# EAGLE design deskav2 (EAGLE 6.5.0)
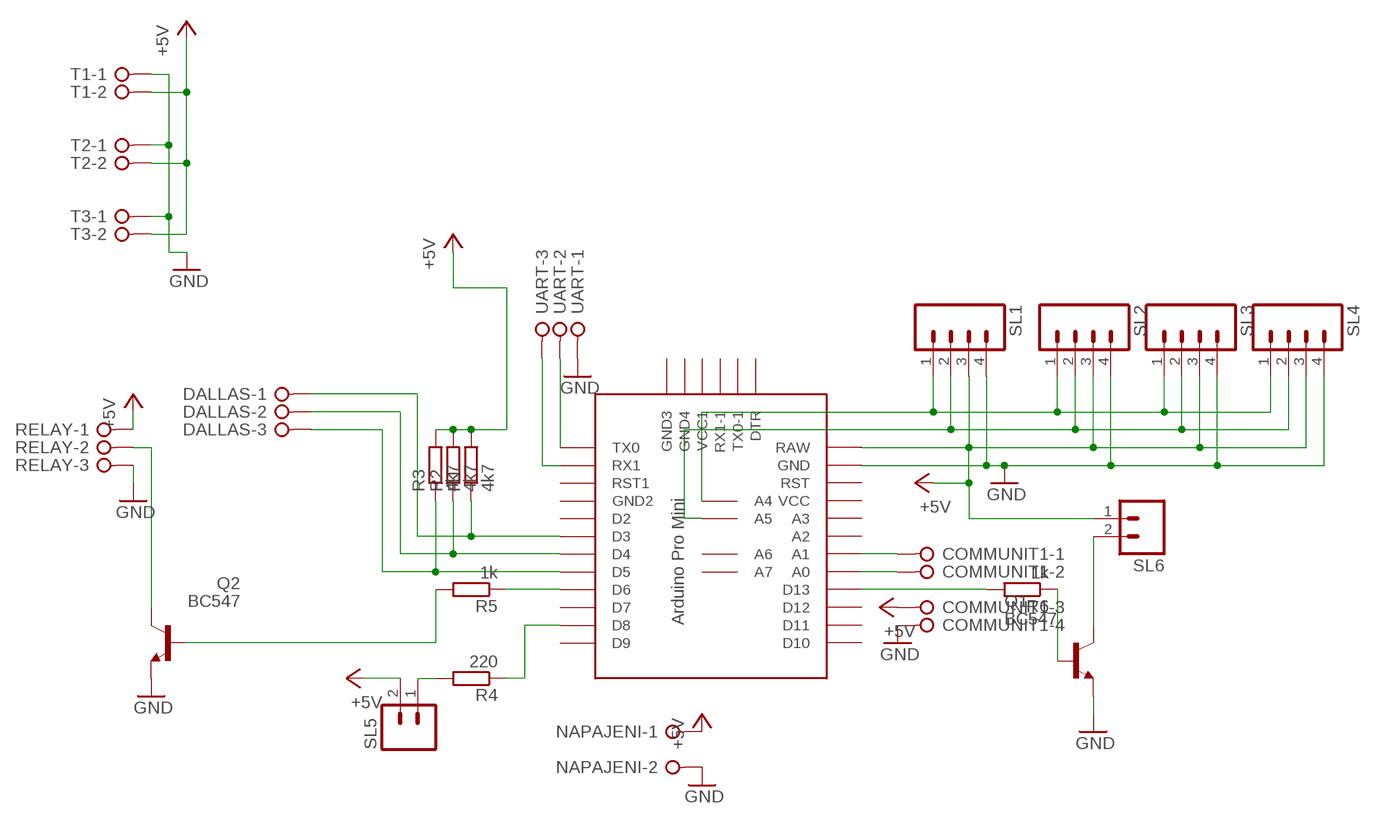
[diagram p0: schematic, sheet 1]

## Parts
COMMUNIT1  W237-04P  [W237-4P]
DALLAS  W237-3E  [W237-3E]
NAPAJENI  W237-02P  [W237-132]
Q1  BC547  [TO92]
Q2  BC547  [TO92]
R1  4k7  R-EU_0207/7  [0207/7]
R2  4k7  R-EU_0207/7  [0207/7]
R3  4k7  R-EU_0207/7  [0207/7]
R4  220  R-EU_0207/7  [0207/7]
R5  1k  R-EU_0207/7  [0207/7]
R6  1k  R-EU_0207/7  [0207/7]
RELAY  W237-3E  [W237-3E]
SL1  M04  [04P]
SL2  M04  [04P]
SL3  M04  [04P]
SL4  M04  [04P]
SL5  M02  [02P]
SL6  M02  [02P]
T1  W237-02P  [W237-132]
T2  W237-02P  [W237-132]
T3  W237-02P  [W237-132]
U$1  PRO-MINI-2  [PRO-MINI-2]
UART  W237-3E  [W237-3E]

## Nets
+5V: COMMUNIT1.3 NAPAJENI.1 R1.2 R2.2 R3.2 RELAY.1 SL1.3 SL2.3 SL3.3 SL4.3 SL5.2 SL6.1 T1.2 T2.2 T3.2 U$1.RAW
GND: COMMUNIT1.4 NAPAJENI.2 Q1.1(E) Q2.1(E) RELAY.3 SL1.4 SL2.4 SL3.4 SL4.4 T1.1 T2.1 T3.1 U$1.GND UART.1
N$2: DALLAS.2 R2.1 U$1.D4
N$3: DALLAS.3 R3.1 U$1.D5
N$4: R5.1 U$1.D6
N$5: R4.1 U$1.D8
N$6: R4.2 SL5.1
N$7: Q1.2(B) R6.1
N$8: COMMUNIT1.1 U$1.A1
N$9: U$1.TX0 UART.2
N$10: U$1.RX1 UART.3
N$11: SL1.1 SL2.1 SL3.1 SL4.1 U$1.A4
N$12: SL1.2 SL2.2 SL3.2 SL4.2 U$1.A5
N$13: Q2.2(B) R5.2
N$14: Q2.3(C) RELAY.2
N$15: Q1.3(C) SL6.2
N$16: R6.2 U$1.D13
N$17: COMMUNIT1.2 U$1.A0
N$18: DALLAS.1 R1.1 U$1.D3
Unconnected: U$1.A2 U$1.A3 U$1.A6 U$1.A7 U$1.D2 U$1.D7 U$1.D9 U$1.D10 U$1.D11 U$1.D12 U$1.DTR U$1.GND1(GND2) U$1.GND2(GND3) U$1.GND3(GND4) U$1.RST U$1.RST1 U$1.RX1-1 U$1.TX0-1 U$1.VCC U$1.VCC1

## Library data of the parts
COMMUNIT1 = con-wago-508:W237-04P: WAGO SREW CLAMP; OC_FARNELL: unknown; OC_NEWARK: unknown
DALLAS RELAY UART = con-wago-508:W237-3E: WAGO SREW CLAMP; OC_FARNELL: unknown; OC_NEWARK: unknown
NAPAJENI T1-T3 = con-wago-508:W237-02P: WAGO SREW CLAMP; OC_FARNELL: unknown; OC_NEWARK: unknown
Q1 Q2 = transistor-npn:BC547*: NPN Transistor
R1-R6 = rcl:R-EU_: RESISTOR, European symbol
SL1-SL4 = con-amp-quick:M04: AMP QUICK CONNECTOR; OC_FARNELL: unknown; OC_NEWARK: unknown
SL5 SL6 = con-amp-quick:M02: AMP QUICK CONNECTOR; OC_FARNELL: unknown; OC_NEWARK: unknown
U$1 = Arduino-clone:PRO-MINI-2: Arduino Pro Mini Layout 2 Sparkfun.com

## Board
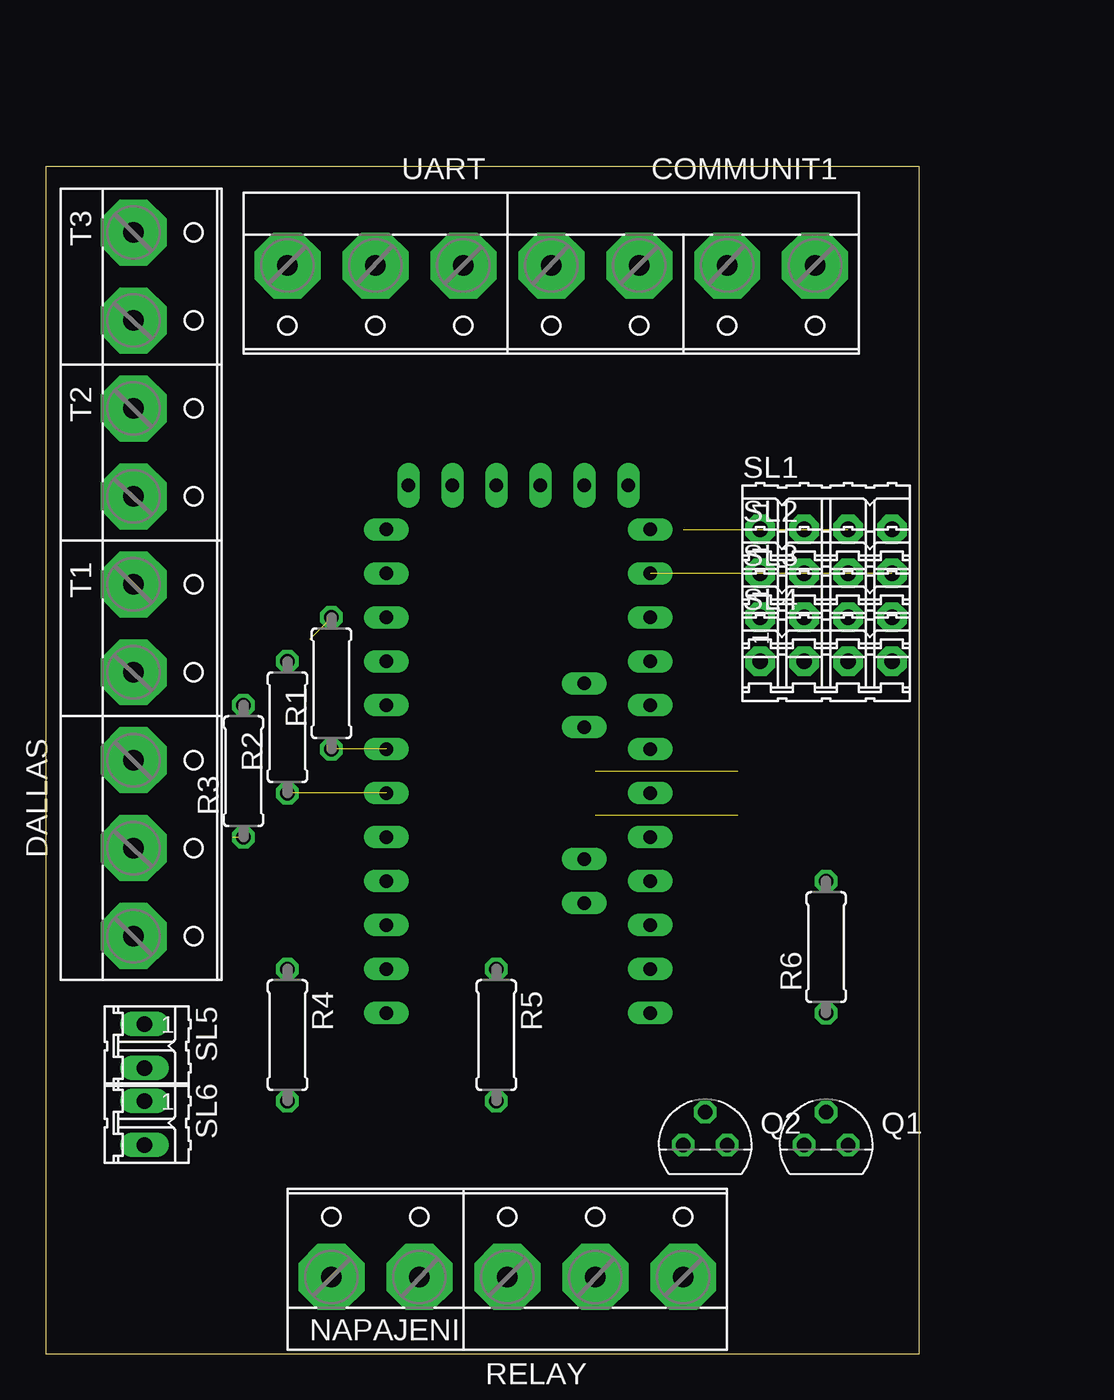
[diagram p1: board, top side]
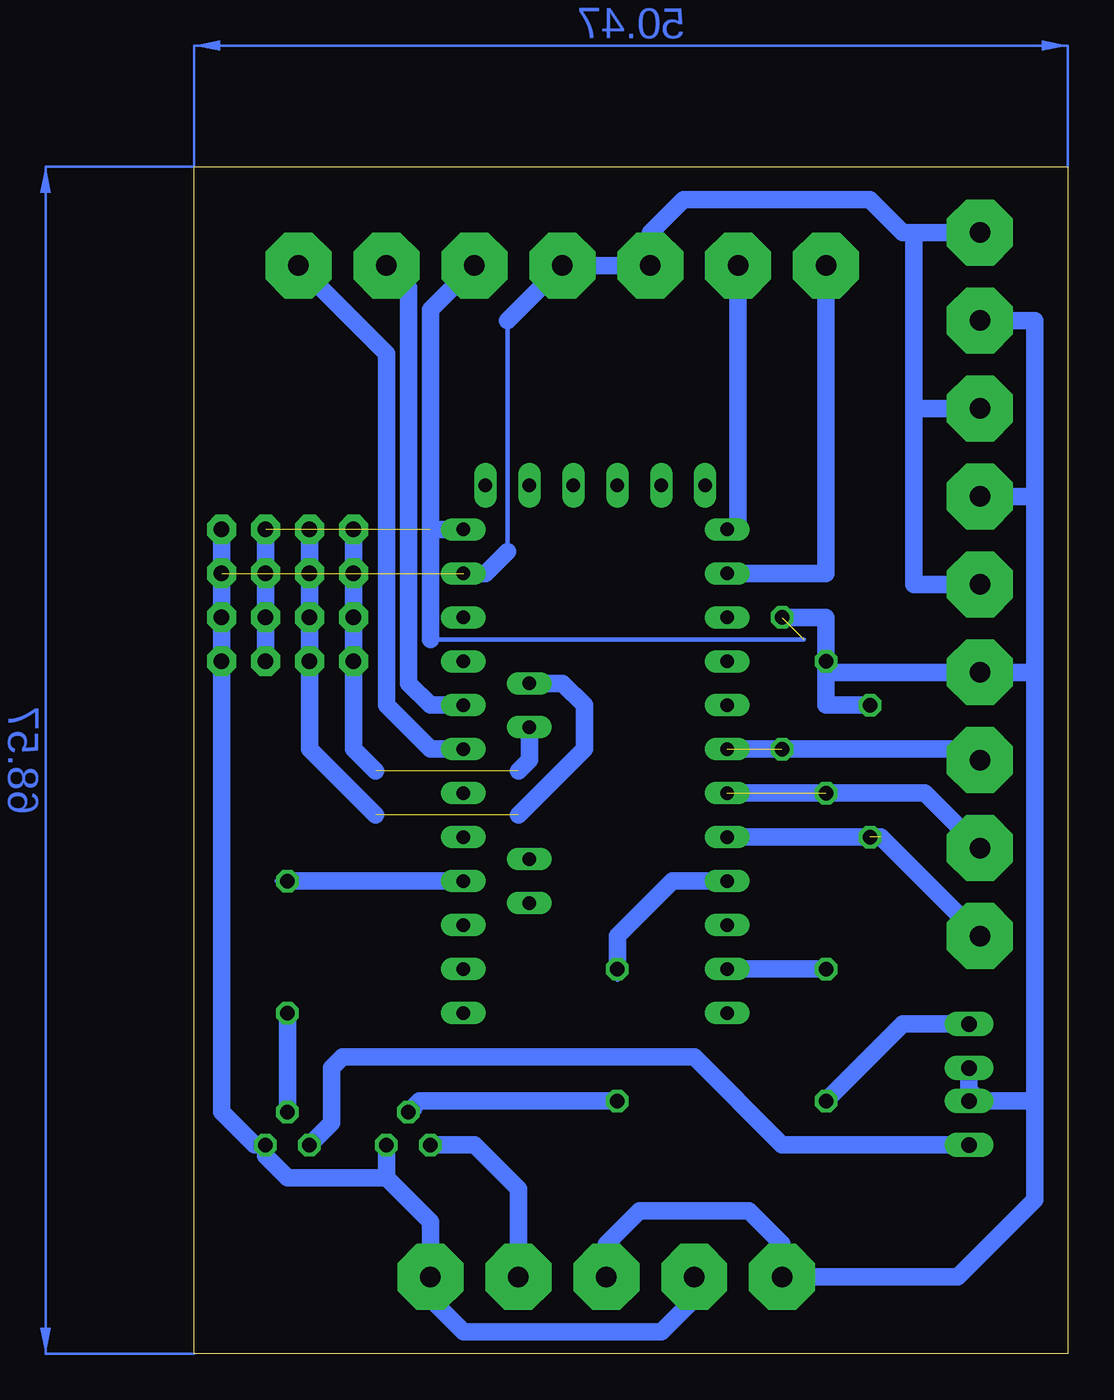
[diagram p2: board, bottom side, seen from below]

Size 50.47 x 68.57 mm. Coordinates in mm from the lower left corner, seen from the top.
Outline: 0,0 50.47,0 50.47,68.57 0,68.57 0,0
Copper layers (1*16): Top 0.035mm / dielectric 1.5mm / Bottom 0.035mm
Design rules "default": minimum track width 10mil, minimum drill 24mil, track to track 8mil, track to pad 8mil, pad to pad 8mil, via to via 8mil, smd to smd 8mil, copper to edge 40mil, drill to drill 8mil, minimum pad ring 10mil, minimum via ring 8mil, stop-mask expansion 4mil, vias tented up to drill 0mil, thermal gap 10mil

### Footprints (pad centres in the part's own frame; a part is rotated, then mirrored left to right if it is on the bottom)
W237-4P = drill 1.194 pad 3.81 octagon: 1 -7.62,-0.635; 2 -2.54,-0.635; 3 2.54,-0.635; 4 7.62,-0.635
W237-3E = drill 1.194 pad 3.81 octagon: 1 -5.08,-0.635; 2 0,-0.635; 3 5.08,-0.635
W237-132 = drill 1.194 pad 3.81 octagon: 1 -2.54,-0.635; 2 2.54,-0.635
TO92 = drill 0.813 octagon: 1 1.27,0; 2 0,1.905; 3 -1.27,0
0207/7 = drill 0.813 octagon: 1 -3.81,0; 2 3.81,0
04P = drill 0.914 pad 1.676 octagon: 1 -3.81,0; 2 -1.27,0; 3 1.27,0; 4 3.81,0
02P = drill 0.914 long: 1 -1.27,0; 2 1.27,0
PRO-MINI-2 = drill 0.8 long: A0 6.35,2.54; A1 6.35,0; A2 6.35,-2.54; A3 6.35,-5.08; A4 2.54,1.27; A5 2.54,3.81; A6 2.54,-8.89; A7 2.54,-6.35; D2 -8.89,2.54; D3 -8.89,0; D4 -8.89,-2.54; D5 -8.89,-5.08; D6 -8.89,-7.62; D7 -8.89,-10.16; D8 -8.89,-12.7; D9 -8.89,-15.24; D10 6.35,-15.24; D11 6.35,-12.7; D12 6.35,-10.16; D13 6.35,-7.62; DTR 5.08,15.24; GND 6.35,10.16; GND1 -8.89,5.08; GND2 -7.62,15.24; GND3 -5.08,15.24; RAW 6.35,12.7; RST 6.35,7.62; RST1 -8.89,7.62; RX1 -8.89,10.16; RX1-1 0,15.24; TX0 -8.89,12.7; TX0-1 2.54,15.24; VCC 6.35,5.08; VCC1 -2.54,15.24

### Placement (x,y rotation side)
COMMUNIT1  36.83,62.23 180 top
DALLAS  5.71,29.21 270 top
NAPAJENI  19.05,5.08 0 top
Q1  45.09,12.06 0 top
Q2  38.1,12.06 0 top
R1  16.51,38.73 90 top
R2  13.97,36.2 90 top
R3  11.43,33.66 90 top
R4  13.97,18.41 270 top
R5  26.04,18.41 270 top
R6  45.09,23.5 90 top
RELAY  31.75,5.08 0 top
SL1  45.09,47.62 0 top
SL2  45.09,45.09 0 top
SL3  45.09,42.55 0 top
SL4  45.09,40.01 0 top
SL5  5.71,17.78 270 top
SL6  5.71,13.34 270 top
T1  5.71,41.91 270 top
T2  5.71,52.07 270 top
T3  5.71,62.23 270 top
U$1  28.57,34.92 0 top
UART  19.05,62.23 180 top

### Tracks (layer width: path | path; a pad name or v marks a point on that pad's centre or on a via)
+5V  (2 unrouted)
  Bottom 0.254: 15.24,41.27 36.83,41.27
  Bottom 1.016: T3.2 1.91,59.69 1.91,49.53 | 1.91,49.53 T2.2 | 1.91,39.37 1.91,49.53 | R2.2 13.97,39.37 T1.2 1.91,39.37 | R2.2 13.97,42.55 R1.2 | R3.2 13.97,37.47 R2.2 | 1.91,39.37 1.91,14.61 | RELAY.1 26.67,6.35 24.77,8.26 18.41,8.26 16.51,6.35 NAPAJENI.1 6.35,4.45 1.91,8.89 1.91,14.61 | SL1.3 SL2.3 SL3.3 SL4.3 | 36.83,41.27 36.83,47.62 | 36.83,47.62 U$1.RAW | COMMUNIT1.3 36.83,60.33 36.83,47.62 | SL6.1 5.08,14.61 | 5.08,14.61 1.91,14.61 | SL5.2 5.71,15.24 5.08,14.61
GND  (1 unrouted)
  Bottom 0.254: 32.38,59.69 32.38,46.35
  Bottom 1.016: T3.1 8.89,64.77 | 8.89,64.77 8.89,54.61 | 8.89,54.61 T2.1 | T1.1 8.89,44.45 8.89,54.61 | NAPAJENI.2 21.59,3.17 23.49,1.27 34.92,1.27 36.83,3.17 RELAY.3 36.83,7.62 39.37,10.16 | Q2.1 39.37,10.16 | 39.37,10.16 45.09,10.16 46.35,11.43 Q1.1 46.99,12.06 48.89,13.97 SL4.4 SL3.4 SL2.4 SL1.4 | 8.89,64.77 9.53,64.77 11.43,66.67 22.22,66.67 24.13,64.77 UART.1 COMMUNIT1.4 32.38,59.69 | U$1.GND 33.66,45.09 32.38,46.35
N$2  (1 unrouted)
  Bottom 1.016: U$1.D4 8.26,32.38 DALLAS.2
N$3  (1 unrouted)
  Bottom 1.016: U$1.D5 10.79,29.84 DALLAS.3 4.44,23.5
N$4
  Bottom 0.254: 26.04,21.59 R5.1
  Bottom 1.016: U$1.D6 22.86,27.3 26.04,24.13 R5.1
N$5
  Bottom 1.016: U$1.D8 R4.1
N$6
  Bottom 1.016: R4.2 9.53,19.05 SL5.1
N$7
  Bottom 1.016: Q1.2 R6.1
N$8
  Bottom 1.016: U$1.A1 36.83,34.92 39.37,37.47 39.37,57.78 COMMUNIT1.1
N$9
  Bottom 1.016: UART.2 19.05,47.62 U$1.TX0
N$10
  Bottom 1.016: UART.3 13.97,45.09 U$1.RX1
N$11  (1 unrouted)
  Bottom 1.016: U$1.A4 31.12,34.29 31.75,33.66 | 40,33.66 41.27,34.92 SL4.1 SL3.1 SL2.1 SL1.1
N$12  (1 unrouted)
  Bottom 1.016: U$1.A5 29.21,38.73 27.94,37.47 27.94,34.92 31.75,31.11 | SL1.2 SL2.2 SL3.2 SL4.2 43.81,34.92 40,31.11
N$13
  Bottom 0.254: Q2.2 37.46,13.97
  Bottom 1.016: R5.2 37.46,14.61 Q2.2
N$14
  Bottom 1.016: Q2.3 34.29,12.06 31.75,9.53 RELAY.2
N$15
  Bottom 1.016: Q1.3 42.55,13.34 42.55,16.51 41.91,17.14 21.59,17.14 16.51,12.06 SL6.2
N$16
  Bottom 0.254: R6.2 45.72,27.3
  Bottom 1.016: U$1.D13 R6.2
N$17
  Bottom 1.016: U$1.A0 36.83,37.47 38.1,38.73 38.1,61.59 COMMUNIT1.2
N$18  (1 unrouted)
  Bottom 1.016: U$1.D3 5.08,34.92 DALLAS.1
(copper drawn outside any net)
  shapes: Bottom area x2